# Altium schematic sheet USB_FS.SchDoc
size A3; SheetNumber: 5; SheetTotal: 6
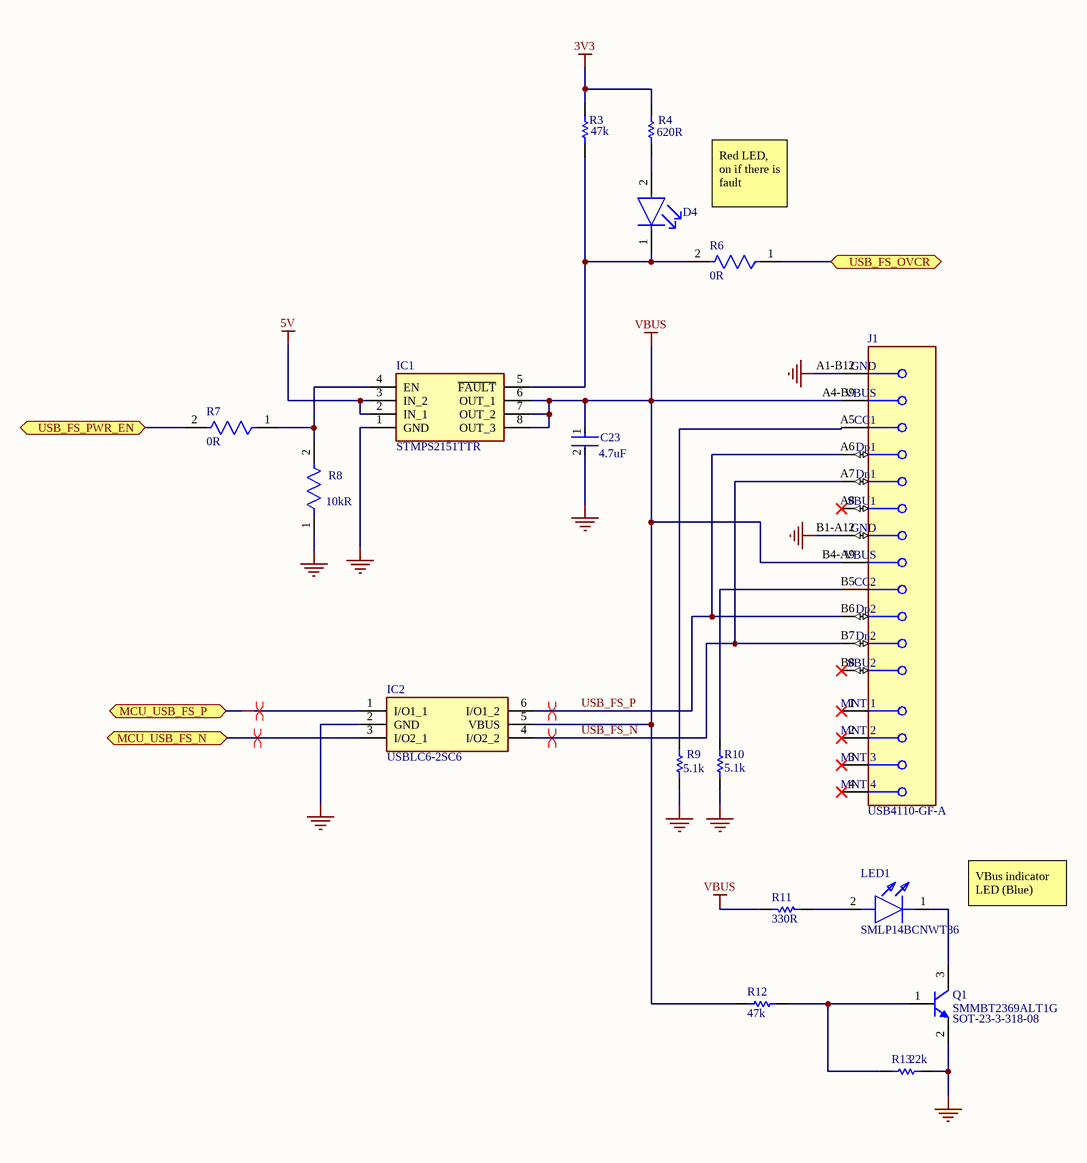
[diagram p0: USB_FS.SchDoc]

## Parts
C23  Capacitance: 4.7uF  [FP-GCM21B-0_15-IPC_B]  (hidden comment: GCM21BC71A475KA73K)
D4  SML-P11UTT86R  [FP-SML-P1-MFG]  (value not drawn)
IC1  STMPS2151TTR  [SOP65P490X110-8N]
IC2  USBLC6-2SC6  [SOT95P280X145-6N]
J1  USB4110-GF-A  [FP-USB4110-GF-A-MFG]
LED1  SMLP14BCNWT86  [SMLP14BCNWT86]
Q1  SMMBT2369ALT1G  PackageReference: SOT-23-3-318-08  [ONSC-SOT-23-3-318-08_V]
R3  Resistance: 47k  [RESC1005X40X25LL05T10]  (hidden comment: RC0402JR-0747KL)
R4  Resistance: 620R  [RESC1005X40X25ML05T10]  (hidden comment: RC0402JR-07620RL)
R6  Resistance: 0R  [FP-RMCF0402-MFG]  (hidden comment: RMCF0402ZT0R00)
R7  Resistance: 0R  [FP-RMCF0402-MFG]  (hidden comment: RMCF0402ZT0R00)
R8  Resistance: 10kR  [FP-RC0402-0_4-IPC_A]  (hidden comment: RC0402FR-1310KL)
R9  Resistance: 5.1k  [RESC1005X40X25ML05T10]  (hidden comment: RC0402JR-0751KL)
R10  Resistance: 5.1k  [RESC1005X40X25ML05T10]  (hidden comment: RC0402JR-0751KL)
R11  Parameter: 330R  [RESC1005X40X25NL05T10]  (hidden comment: RC0402JR-07330RL)
R12  Resistance: 47k  [RESC1005X40X25LL05T10]  (hidden comment: RC0402JR-0747KL)
R13  Resistance: 22k  [RESC1005X40X25NL05T10]  (hidden comment: RC0402FR-07422KL)

## Ports
MCU_USB_FS_N (bidir), MCU_USB_FS_P (bidir), USB_FS_OVCR (bidir), USB_FS_PWR_EN (bidir)

## Nets
3V3: R3.2 R4.2
5V: IC1.2(IN_1) IC1.3(IN_2)
GND: C23.2 IC1.1(GND) IC2.2(GND) J1.A1-B12(GND) J1.B1-A12(GND) Q1.2(E) R8.1 R9.1 R10.1 R13.2
VBUS: C23.1 IC1.6(OUT_1) IC1.7(OUT_2) IC1.8(OUT_3) IC2.5(VBUS) J1.A4-B9(VBUS) J1.B4-A9(VBUS) R11.1 R12.2
MCU_USB_FS_N: IC2.3(I/O2_1) ; port MCU_USB_FS_N
MCU_USB_FS_P: IC2.1(I/O1_1) ; port MCU_USB_FS_P
USB_FS_N: IC2.4(I/O2_2) J1.A7(Dn1) J1.B7(Dn2)
USB_FS_OVCR: R6.1 ; port USB_FS_OVCR
USB_FS_P: IC2.6(I/O1_2) J1.A6(Dp1) J1.B6(Dp2)
USB_FS_PWR_EN: R7.2 ; port USB_FS_PWR_EN
NetD4_1: D4.1(C) IC1.5(~{FAULT}) R3.1 R6.2
NetD4_2: D4.2(A) R4.1
NetIC1_4: IC1.4(EN) R7.1 R8.2
NetJ1_A5: J1.A5(CC1) R9.2
NetJ1_B5: J1.B5(CC2) R10.2
NetLED1_1: LED1.1(K) Q1.3(C)
NetLED1_2: LED1.2(A) R11.2
NetQ1_1: Q1.1(B) R12.1 R13.1

Not connected (* = marked no-connect by the designer): J1 1(MNT_1)* 2(MNT_2)* 3(MNT_3)* 4(MNT_4)* A8(SBU1)* B8(SBU2)*

## Layout directives
differential pair: MCU_USB_FS_N, MCU_USB_FS_P, USB_FS_N, USB_FS_P

## Notes on the sheet
- Red LED, on if there is fault
- (near LED1) VBus indicator LED (Blue)

## Library data of the parts
C23 = CMP-06035-044998-1: Ceramic Capacitor for Automotive 4.7uF ±10% 10VDC X7S 0805 Embossed T/R; Voltage Rating (DC): 10V; Max Operating Temperature: 125°C; Height: 1.25mm; Width: 1.25mm; Length: 2mm; Dielectric: X7S; Tolerance: 10%; Min Operating Temperature: -55°C; Case Code (Imperial): 0805; Case Code (Metric): 2012; Depth: 1.25mm; Radiation Hardening: No; Package Quantity: 10000; Mount: Surface Mount; Case/Package: 0805; Voltage Rating: 10V; Packaging: Tape and Reel; Termination: SMD/SMT
D4 = CMP-08952-000008-1: LED RED CLEAR 1006 SMD; Manufacturer: Rohm; Wavelength: 621nm; Led Orientation: Top View; Luminous Intensity: 2.5mcd; Power Dissipation: 50mW; Forward Voltage: 1.8V; Reverse Voltage: 5V; Forward Current: 1mA; Manufacturer Part Number: SML-P11UTT86R; Device Class L2: LEDs; RoHS: TRUE; Device Class L1: Optoelectronics; Colour: Red; Lead Free: Yes; Height: 0.25mm; Automotive: No; Octopart: https://octopart.com/sml-p11utt86r-rohm-39058751; Temperature: -40°C to +85°C; Temperature Range Low: -40°C; Package: SML-P1; ComponentLink2URL: https://www.rohm.com/datasheet/SML-P11UT(R)/sml-p11-e; ComponentLink2Description: Datasheet; Category: Diode; Temperature Range High: +85°C; Device Class L3: unset; Mouser Description: Led, Picoled, Red, 621 Nm, 1.8 V, 1 Ma, 2.5 Mcd; Digikey Description: LED RED CLEAR 1006 SMD
IC1 = STMPS2151TTR: Integrated Circuit; Manufacturer_Name: STMicroelectronics; Datasheet Link: https://www.st.com/resource/en/datasheet/stmps2141.pdf; Height: 1.1mm; Manufacturer_Part_Number: STMPS2151TTR; Mouser Part Number: 511-STMPS2151TTR; Mouser Price/Stock: https://www.mouser.co.uk/ProductDetail/STMicroelectronics/STMPS2151TTR?qs=qolwYojYp3TtdEE8TCWfkg%3D%3D; Arrow Part Number: STMPS2151TTR; Arrow Price/Stock: https://www.arrow.com/en/products/stmps2151ttr/stmicroelectronics
IC2 = USBLC6-2SC6: Integrated Circuit; Manufacturer_Name: STMicroelectronics; Datasheet Link: https://www.st.com/resource/en/datasheet/usblc6-2.pdf; Height: 1.45mm; Manufacturer_Part_Number: USBLC6-2SC6; Mouser Part Number: 511-USBLC6-2SC6; Mouser Price/Stock: https://www.mouser.co.uk/ProductDetail/STMicroelectronics/USBLC6-2SC6?qs=po45yt2pPpu%2FhNIlwQdTlg%3D%3D; Arrow Part Number: USBLC6-2SC6; Arrow Price/Stock: https://www.arrow.com/en/products/usblc6-2sc6/stmicroelectronics?utm_currency=USD&region=europe
J1 = CMP-245163-000002-1: CONN USB 2.0 TYPE-C R/A SMT; Manufacturer: GCT; Conn Orientation: Right Angle; Usb Standard: USB 2.0; Voltage Rating: 20V; Current Rating: 3/4.25/1.25/0.25A; Number Of Contacts: 16; Is Female: yes; Shielding: true; Standoff Height: 0.1mm; Octopart: https://octopart.com/usb4110-gf-a-gct-103941985; Temperature: -40°C to +85°C; RoHS: TRUE; Automotive: No; Contact Material: Gold,Nickel; Device Class L1: Connectors; Device Class L2: USB Connectors; Package: 0; Lead Free: Yes; ComponentLink2URL: https://gct.co/files/drawings/usb4110.pdf; Temperature Range High: +85°C; Temperature Range Low: -40°C; Height: 3.46mm; Manufacturer Part Number: USB4110-GF-A; ComponentLink2Description: Datasheet; Device Class L3: unset; Digikey Description: CONN USB 2.0 TYPE-C R/A SMT; Category: Conn
LED1 = SMLP14BCNWT86: LED; Manufacturer_Name: ROHM Semiconductor; Datasheet Link: https://fscdn.rohm.com/en/products/databook/datasheet/opto/led/chip_mono/smlp14bcnwt86-e.pdf; Height: 0.25mm; Manufacturer_Part_Number: SMLP14BCNWT86
Q1 = CMP-1048-00582-1: Switching Transistor, NPN Silicon, 3-Pin SOT-23, Pb-Free, Tape and Reel; Manufacturer: On Semiconductor; Note1: 0; IC Continuous (A): 0.2; ComponentLink2Description: Datasheet; Mounting Technology: Surface Mount; ComponentLink1URL: http://www.onsemi.com/; DatasheetVersion: Rev. 8; ComponentLink3URL: http://www.onsemi.cn/pub_link/Collateral/318-08.PDF; ComponentLink3Description: Package Specification; PackageDescription: 3-Pin Small Outline Transistor, Body 2.92 x 1.3 mm, Pitch 0.95 mm; ComponentLink1Description: Manufacturer URL; PackageVersion: Rev. AP, 11/2009; Polarity: NPN; Packing: Tape and Reel; PartNumber: SMMBT2369ALT1G; ComponentLink2URL: http://www.onsemi.cn/pub_link/Collateral/MMBT2369LT1-D.PDF; RoHS: TRUE
R3 R12 = CMP-1011-00114-2: Manufacturer: Yageo / Phycomp; Part Number: RC0402JR-0747KL
R4 = CMP-2002-07079-1: Manufacturer: Yageo / Phycomp; Part Number: RC0402JR-07620RL
R6 R7 = CMP-26527-007617-1: RES 0 OHM JUMPER 1/16W 0402; Power Rating: 63mW; Working Voltage: 50V; Current Rating: 1A; Series: RMCF; RoHS Compliant: Yes; Features: Automotive AEC-Q200; Width: 0.02inch; Depth: 0.5mm; Resistor Type: Thick Film; Number of Terminations: 2; Radiation Hardening: No; Length: 0.039inch; Contact Plating: Tin; Case/Package: 0402; Min Operating Temperature: -55°C; Case Code (Metric): 1005; Construction: Rectangular; Mount: Surface Mount; Max Operating Temperature: 155°C; Max Power Dissipation: 63mW; Height: 0.016inch; Lead Free: Lead Free; Packaging: Tape and Reel; Technology: THICK FILM; Case Code (Imperial): 0402; Military Standard: Not
R8 = CMP-2002-07854-2: RESISTOR 0402 10K 1%; Power Rating: 62.5mW; Voltage Rating (DC): 50V; Temperature Coefficient: 100ppm/°C; REACH SVHC: No SVHC; Case/Package: 0402; Termination: SMD/SMT; Max Operating Temperature: 155°C; Contact Plating: Tin; Resistance Tolerance: 1%; Radiation Hardening: No; Voltage Rating: 50V; Lead Free: Lead Free; Length: 1mm; Depth: 0.5mm; Number of Pins: 2; RoHS Compliant: Yes; Case Code (Imperial): 0402; Case Code (Metric): 1005; Min Operating Temperature: -55°C; Packaging: Tape and Reel; Technology: THICK FILM; Series: RC; Number of Terminations: 2; Resistor Type: Thick Film; Tolerance: 1%; Working Voltage: 50V; Military Standard: Not; Construction: Rectangular
R9 R10 = CMP-2002-08018-1: Manufacturer: Yageo / Phycomp; Part Number: RC0402JR-0751KL
R11 = CMP-2002-07985-1: Manufacturer: Yageo / Phycomp; Part Number: RC0402JR-07330RL
R13 = CMP-1011-00806-2: Manufacturer: Yageo; Part Number: RC0402FR-07422KL